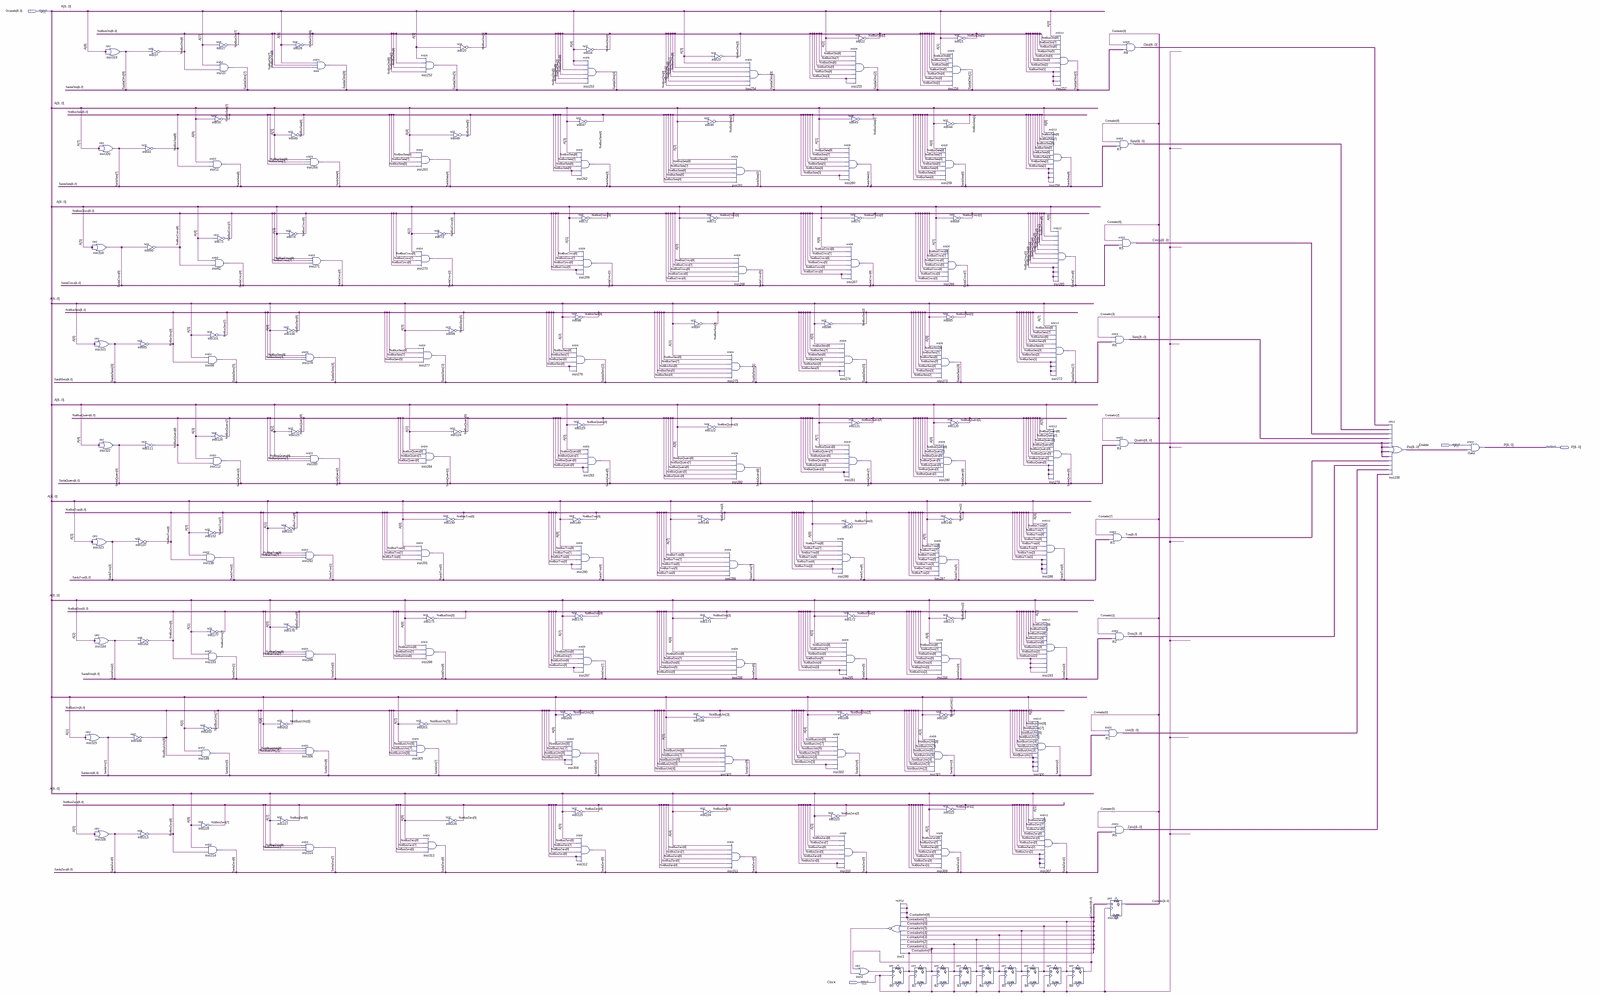
[diagram p0: schematic sheet, whole]
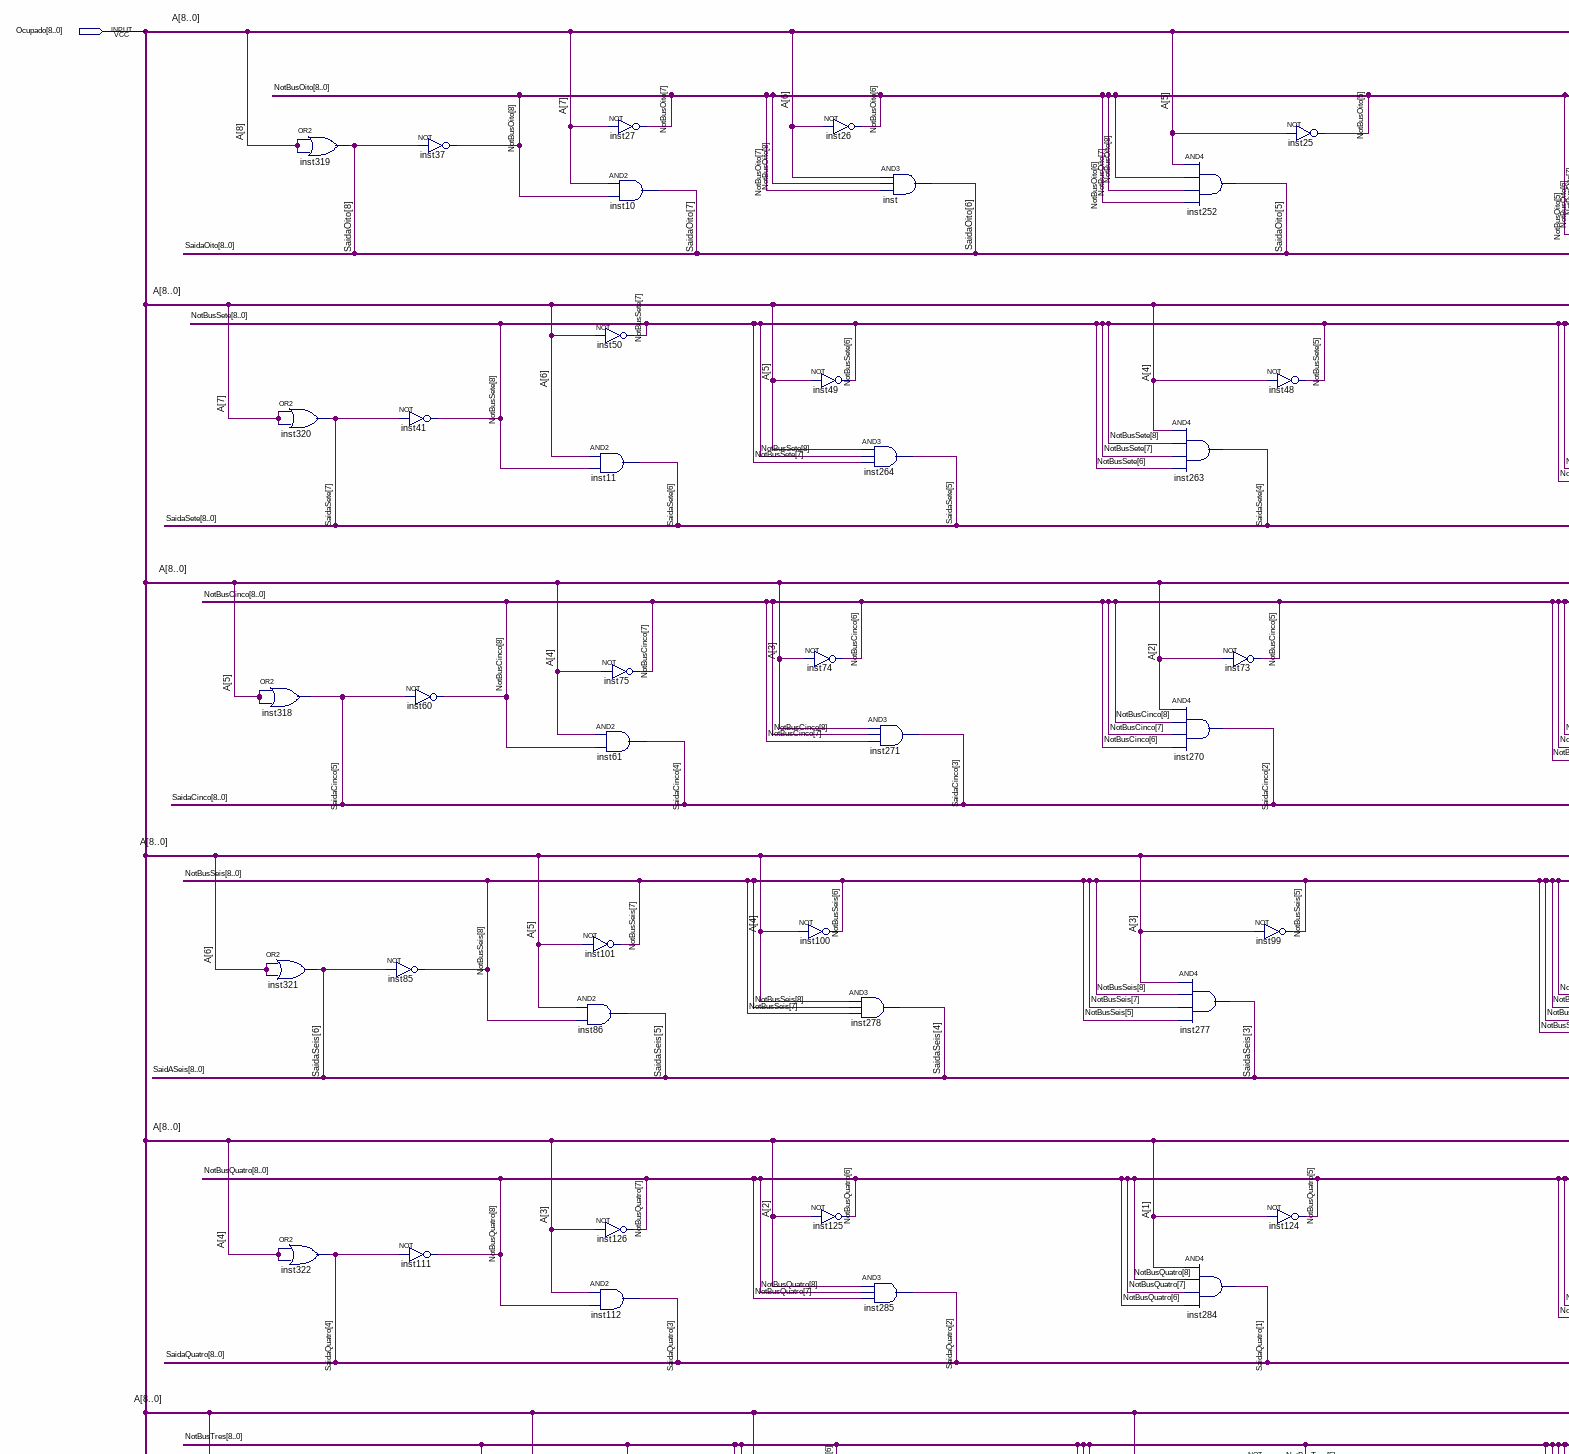
[diagram p1: schematic sheet, upper left part]
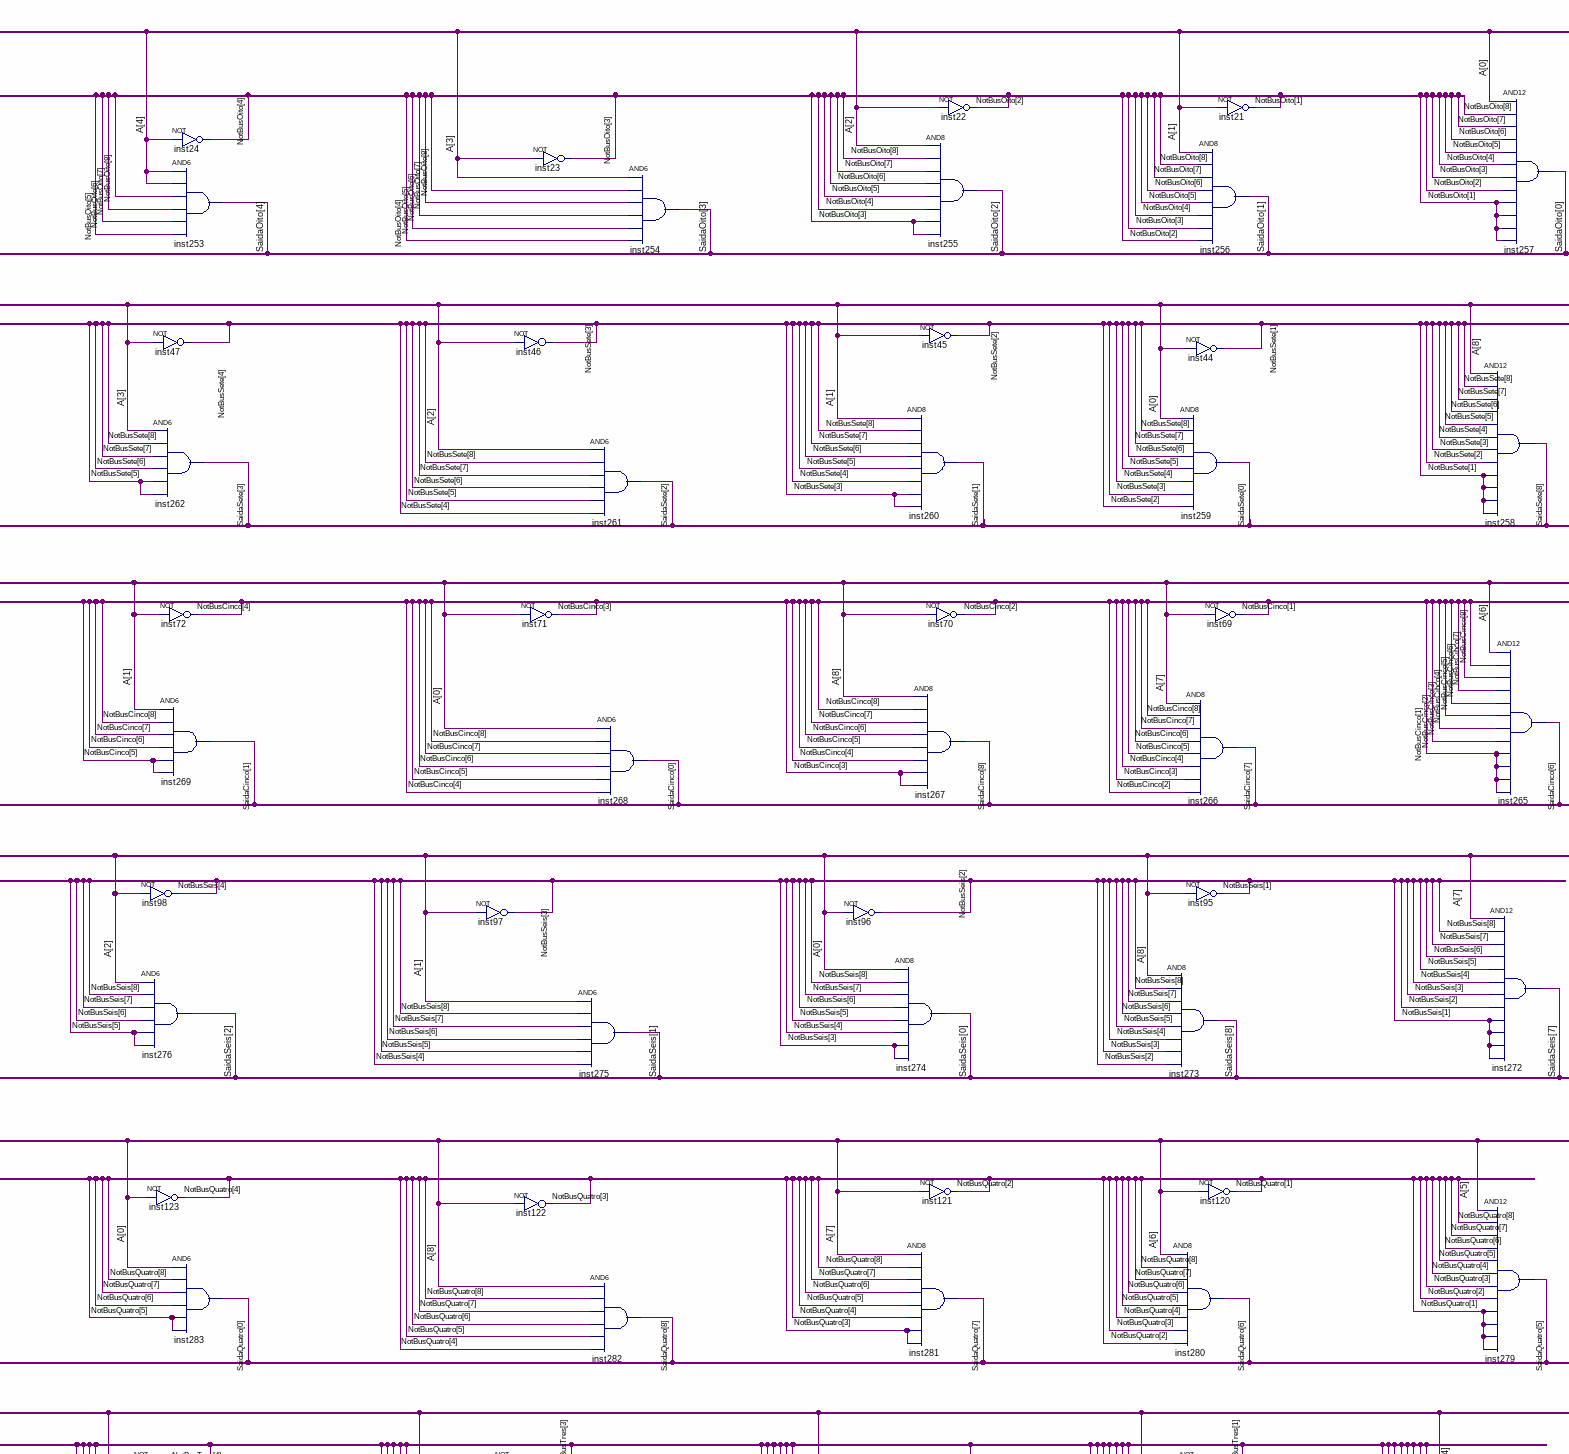
[diagram p2: schematic sheet, upper centre part]
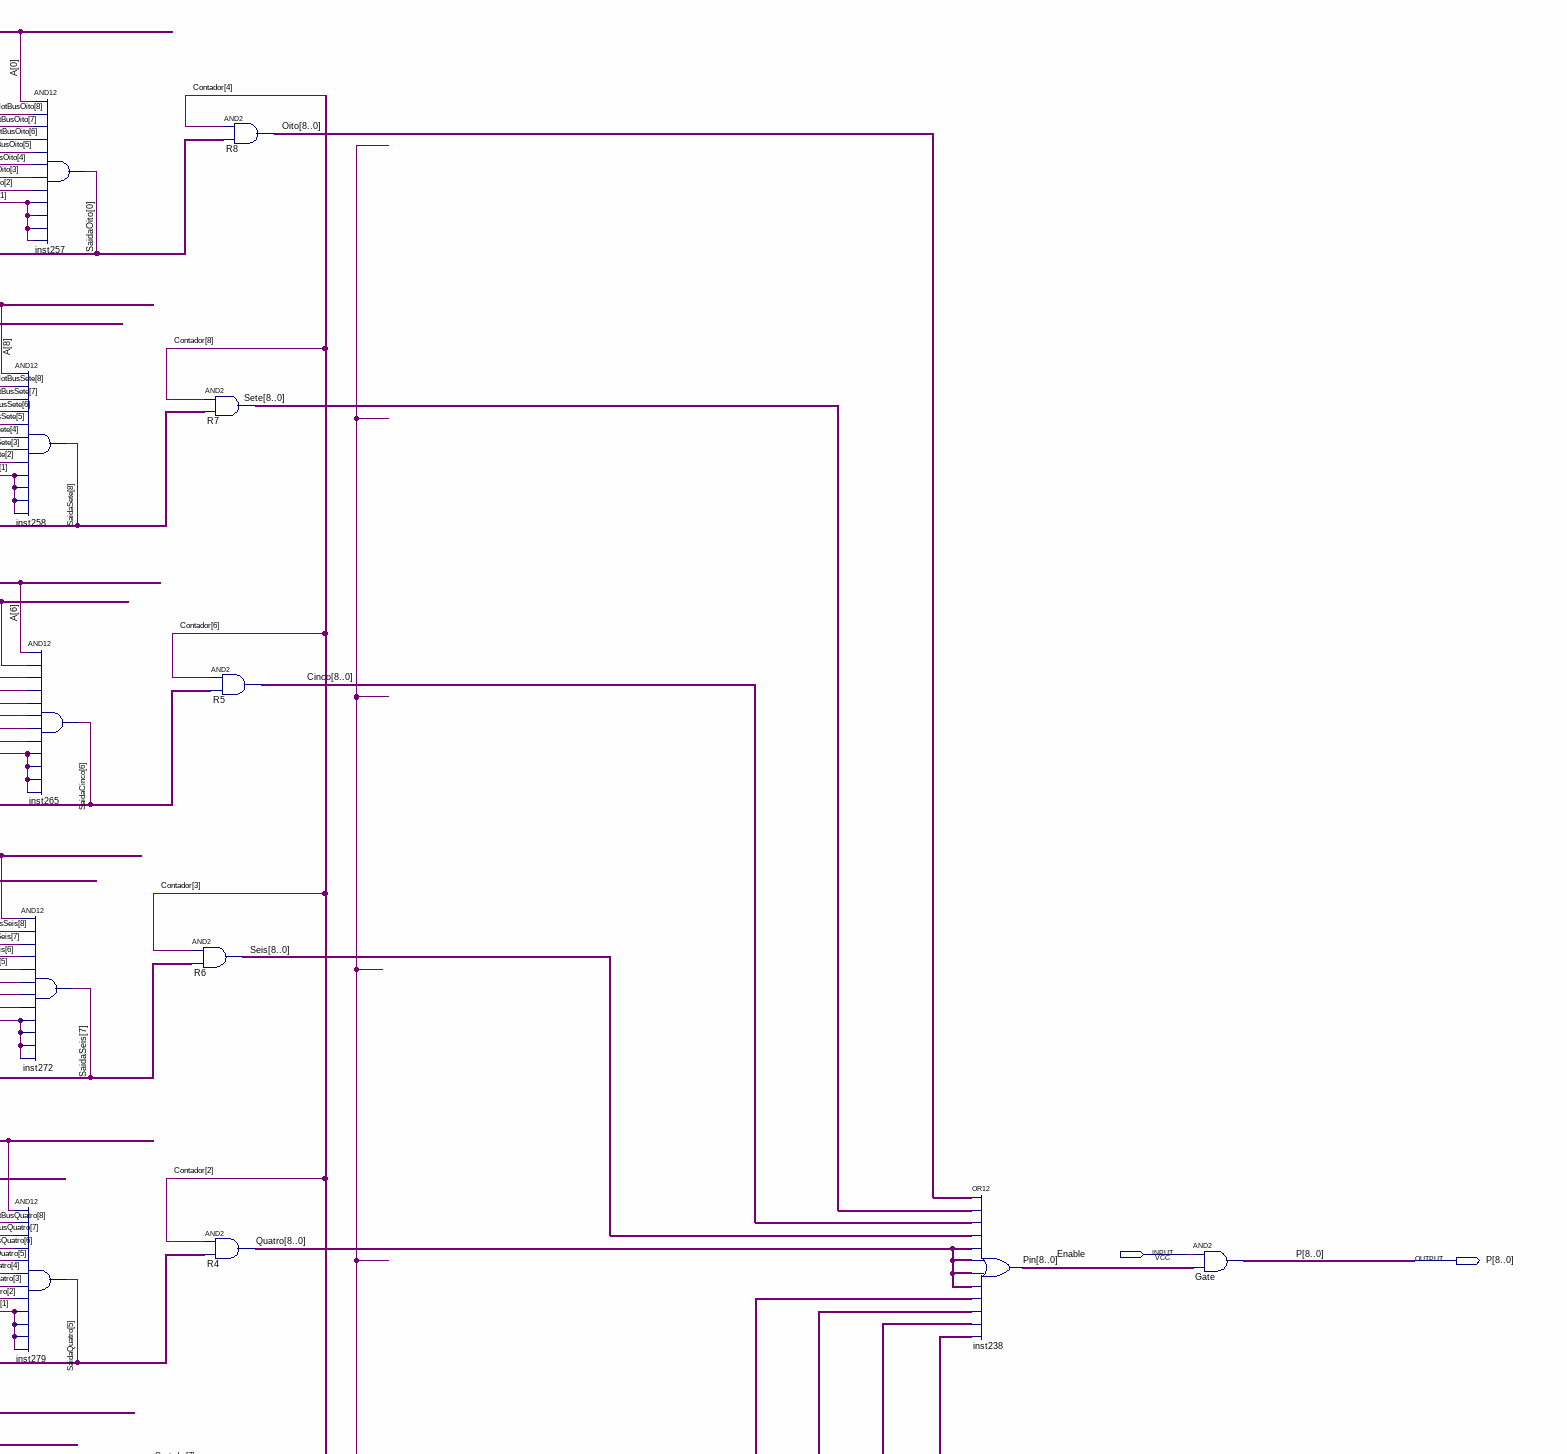
[diagram p3: schematic sheet, upper right part]
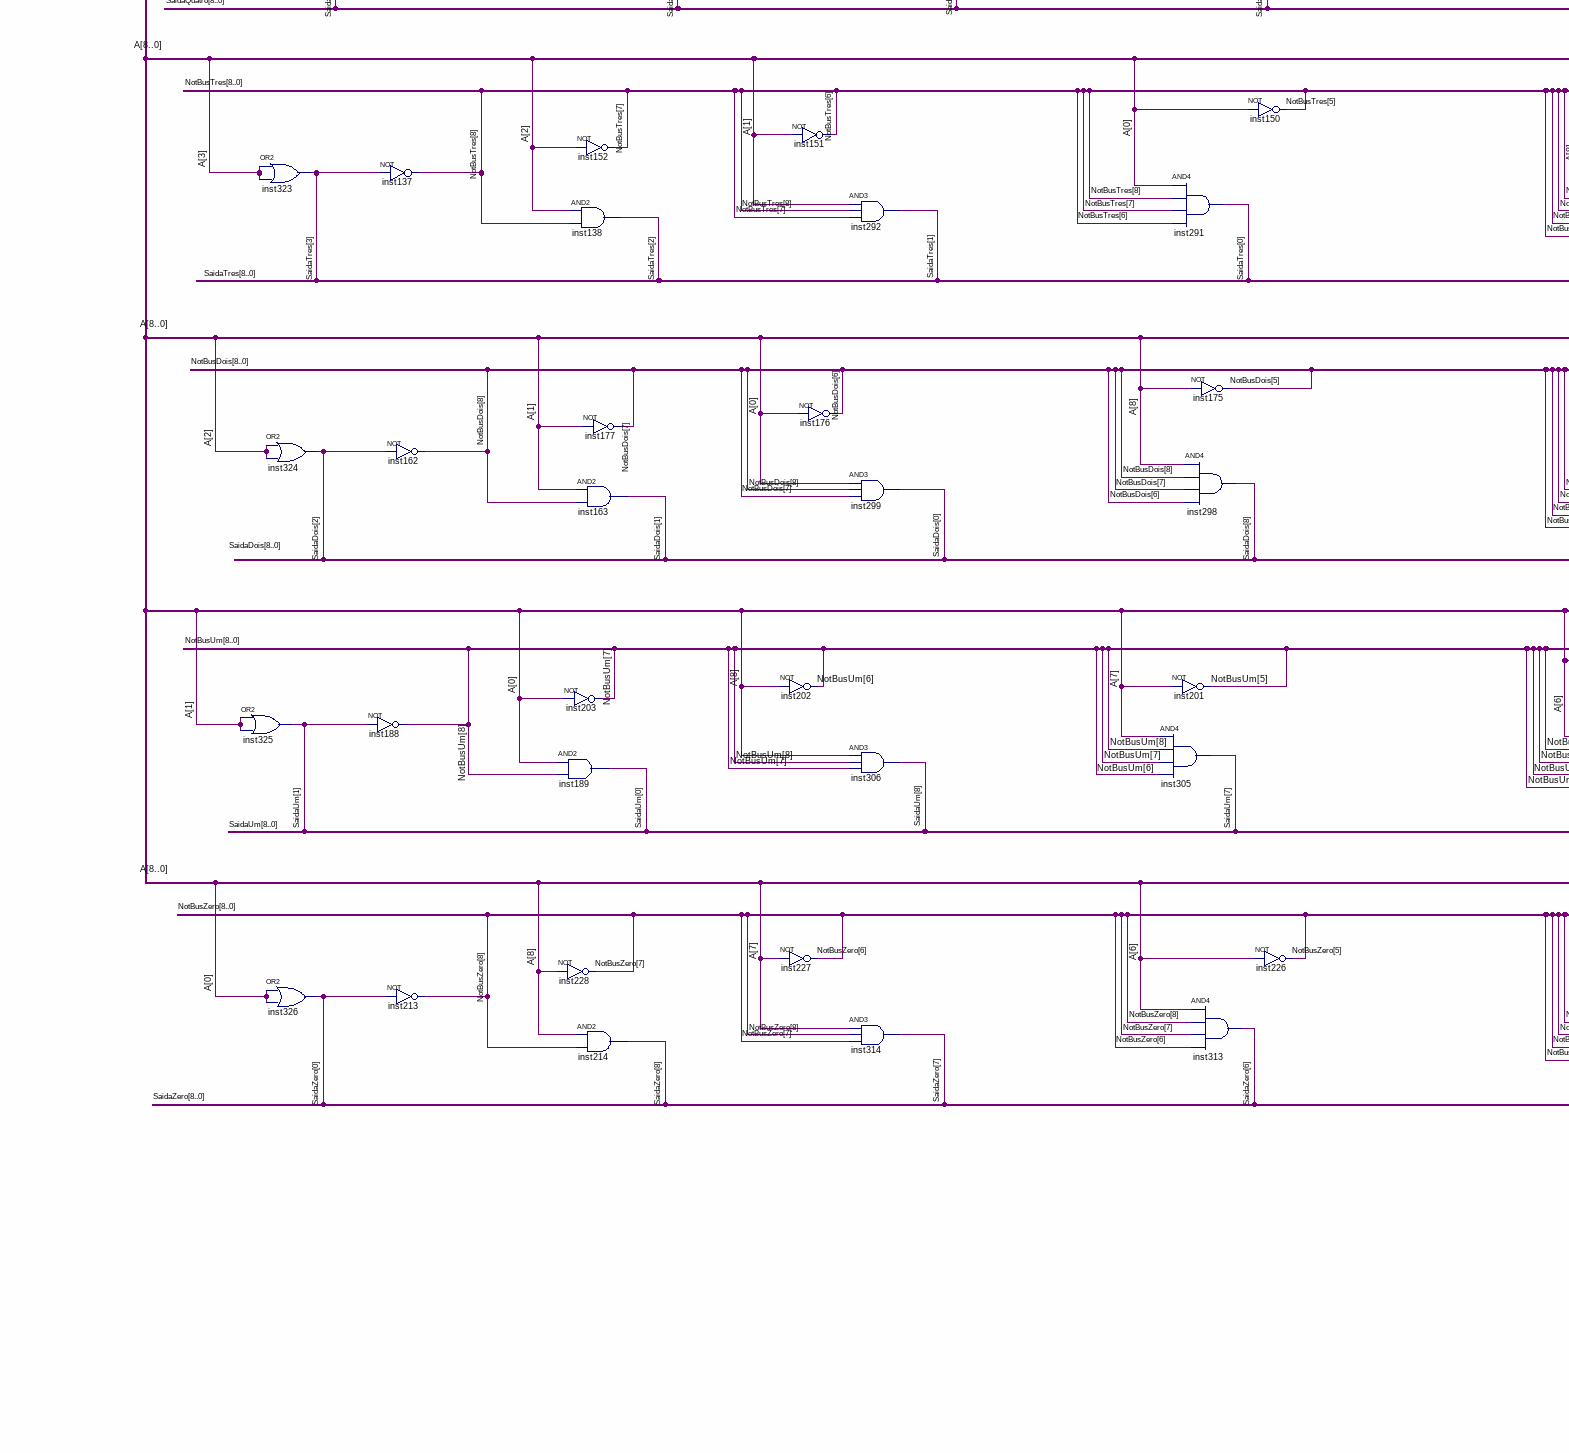
[diagram p4: schematic sheet, lower left part]
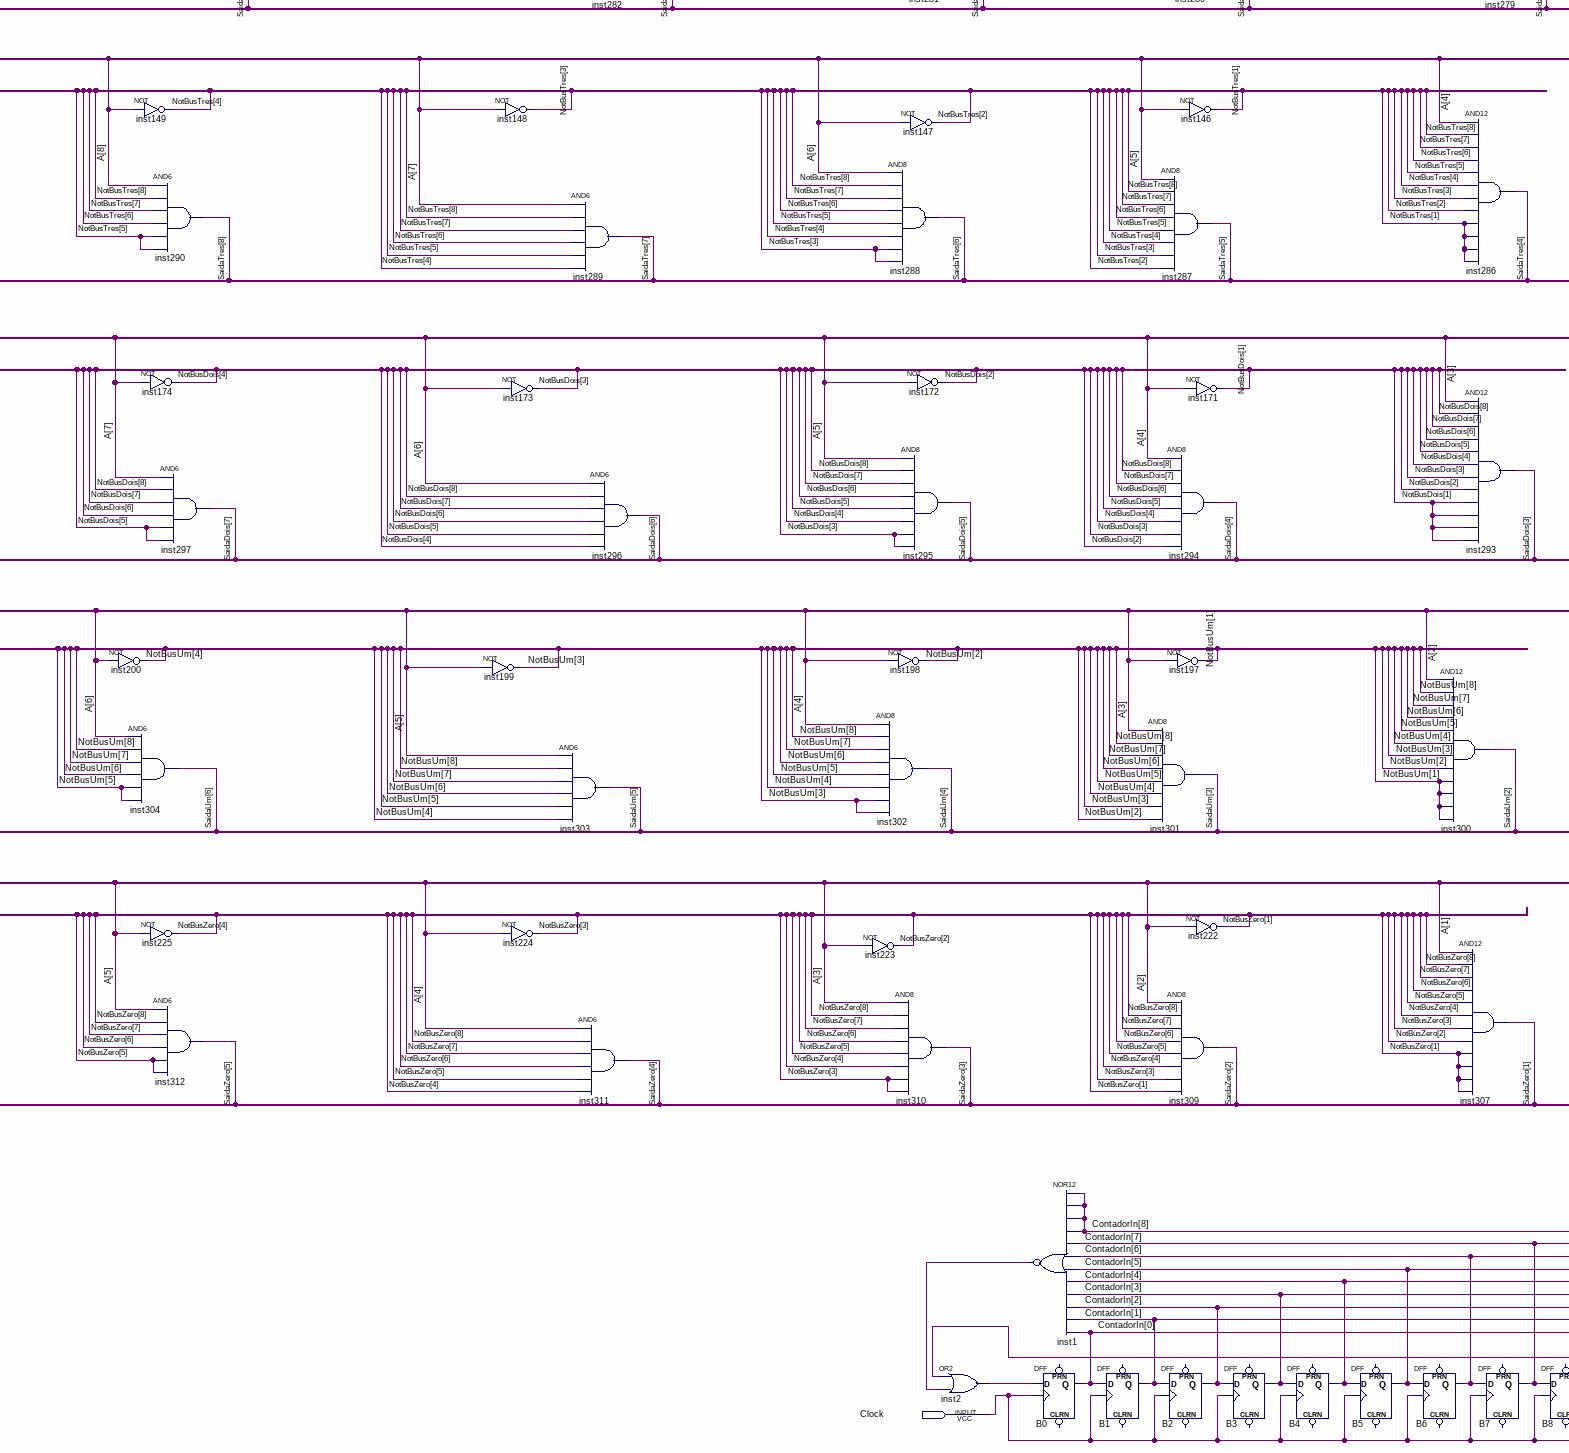
[diagram p5: schematic sheet, lower centre part]
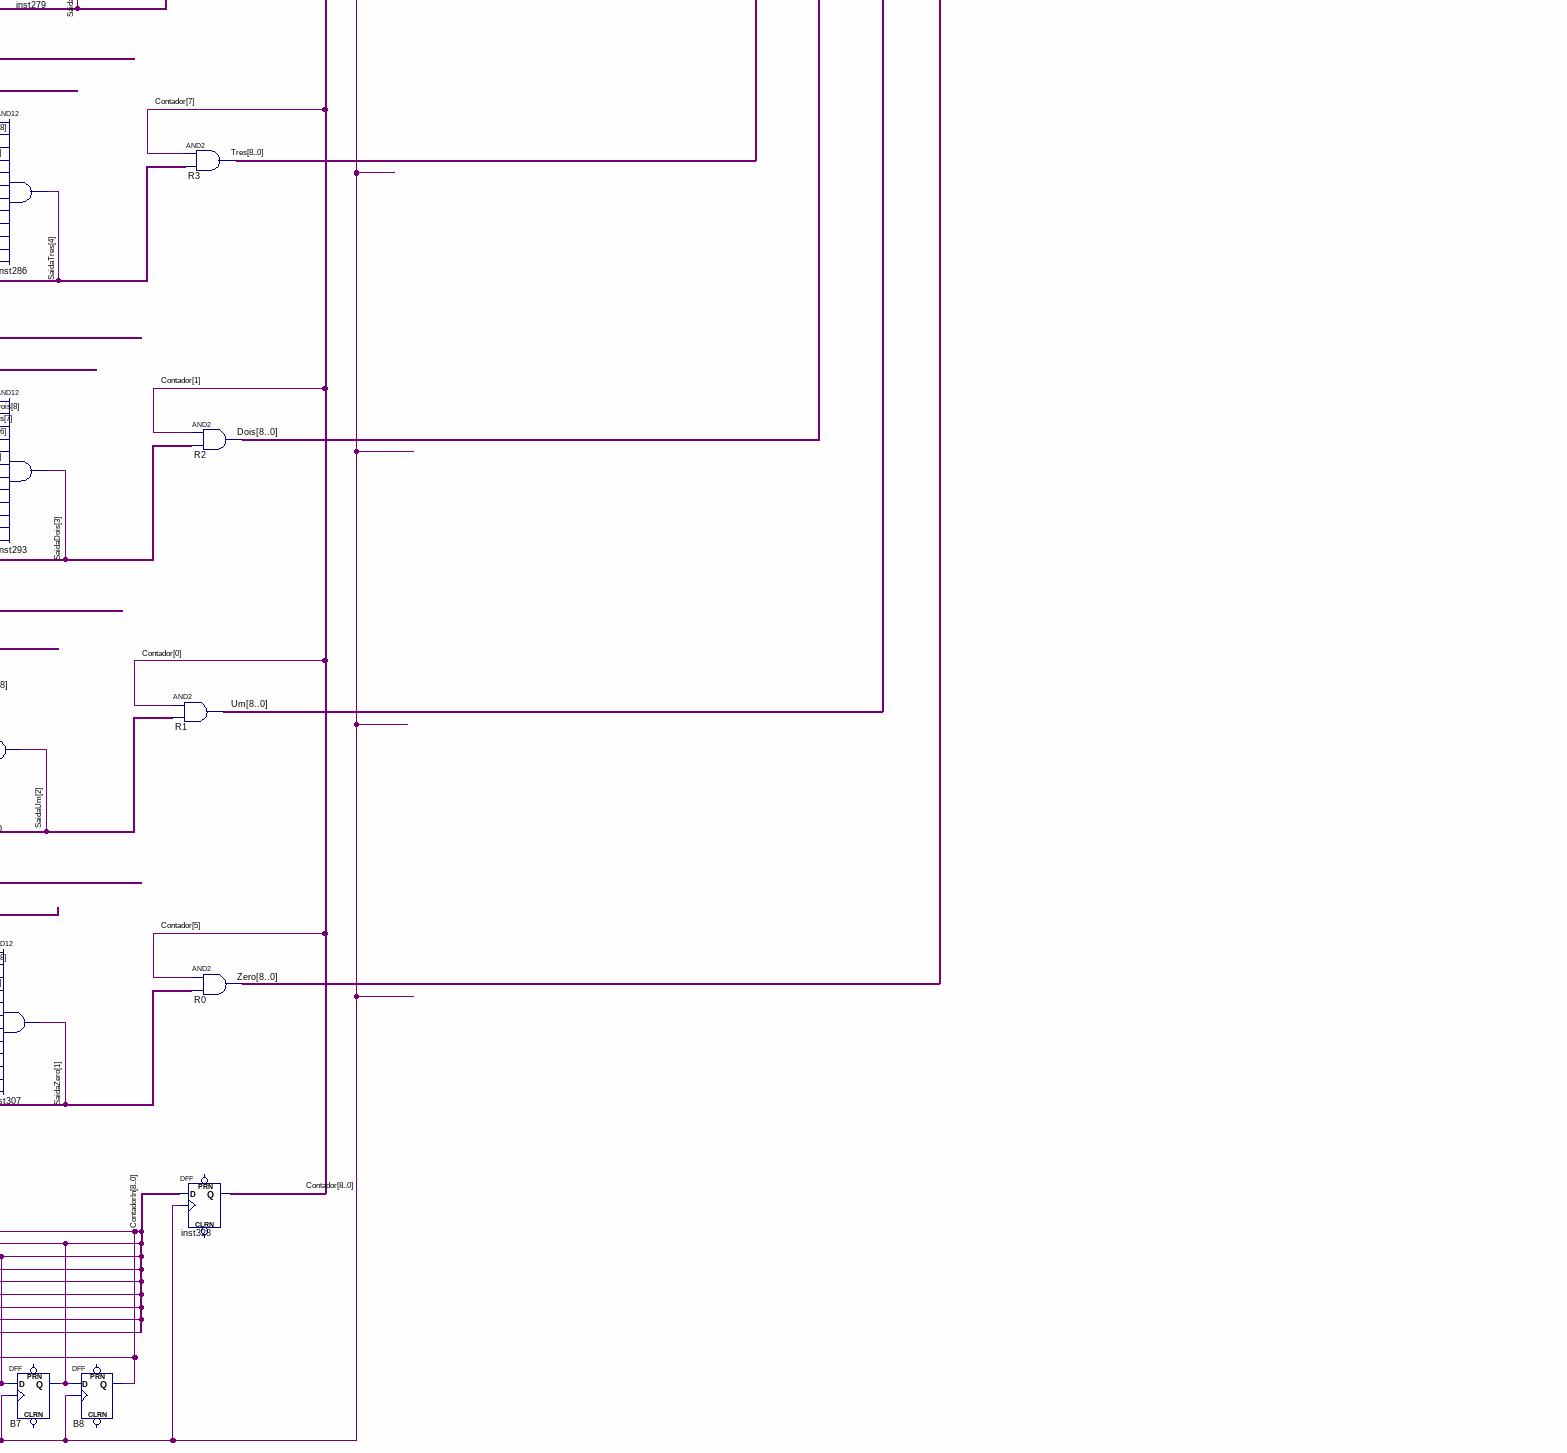
[diagram p6: schematic sheet, lower right part]
// Quartus schematic FRandom.bdf as structural Verilog: 176 symbols, 4 pins
module FRandom (
  input  [8:0] Ocupado,
  input  Enable,
  input  Clock,
  output [8:0] P
);

  wire inst1_out, inst2_out;
  wire [8:0] Cinco, Contador, ContadorIn, Dois, Oito, Pin, Quatro, SaidaCinco, SaidaDois, SaidaOito,
       SaidaQuatro, SaidASeis, SaidaSete, SaidaTres, SaidaUm, SaidaZero, Seis, Sete, Tres, Um, Zero;
  wire [8:1] NotBusCinco, NotBusDois, NotBusOito, NotBusQuatro, NotBusSeis, NotBusSete, NotBusTres, NotBusUm,
       NotBusZero;

  or inst318 (SaidaCinco[5], Ocupado[5], Ocupado[5]);
  or inst321 (SaidASeis[6], Ocupado[6], Ocupado[6]);
  or inst323 (SaidaTres[3], Ocupado[3], Ocupado[3]);
  or inst324 (SaidaDois[2], Ocupado[2], Ocupado[2]);
  or inst325 (SaidaUm[1], Ocupado[1], Ocupado[1]);
  or inst326 (SaidaZero[0], Ocupado[0], Ocupado[0]);
  or inst319 (SaidaOito[8], Ocupado[8], Ocupado[8]);
  or inst320 (SaidaSete[7], Ocupado[7], Ocupado[7]);
  or inst322 (SaidaQuatro[4], Ocupado[4], Ocupado[4]);
  not inst188 (NotBusUm[8], SaidaUm[1]);
  not inst37 (NotBusOito[8], SaidaOito[8]);
  not inst41 (NotBusSete[8], SaidaSete[7]);
  not inst60 (NotBusCinco[8], SaidaCinco[5]);
  not inst85 (NotBusSeis[8], SaidASeis[6]);
  not inst111 (NotBusQuatro[8], SaidaQuatro[4]);
  not inst137 (NotBusTres[8], SaidaTres[3]);
  not inst162 (NotBusDois[8], SaidaDois[2]);
  not inst213 (NotBusZero[8], SaidaZero[0]);
  and inst86 (SaidASeis[5], Ocupado[5], NotBusSeis[8]);
  not inst152 (NotBusTres[7], Ocupado[2]);
  and inst138 (SaidaTres[2], Ocupado[2], NotBusTres[8]);
  and inst163 (SaidaDois[1], Ocupado[1], NotBusDois[8]);
  not inst203 (NotBusUm[7], Ocupado[0]);
  and inst189 (SaidaUm[0], Ocupado[0], NotBusUm[8]);
  not inst228 (NotBusZero[7], Ocupado[8]);
  and inst214 (SaidaZero[8], Ocupado[8], NotBusZero[8]);
  not inst27 (NotBusOito[7], Ocupado[7]);
  and inst10 (SaidaOito[7], Ocupado[7], NotBusOito[8]);
  not inst50 (NotBusSete[7], Ocupado[6]);
  and inst11 (SaidaSete[6], Ocupado[6], NotBusSete[8]);
  not inst75 (NotBusCinco[7], Ocupado[4]);
  and inst61 (SaidaCinco[4], Ocupado[4], NotBusCinco[8]);
  not inst101 (NotBusSeis[7], Ocupado[5]);
  not inst126 (NotBusQuatro[7], Ocupado[3]);
  and inst112 (SaidaQuatro[3], Ocupado[3], NotBusQuatro[8]);
  not inst177 (NotBusDois[7], Ocupado[1]);
  not inst202 (NotBusUm[6], Ocupado[8]);
  not inst227 (NotBusZero[6], Ocupado[7]);
  not inst26 (NotBusOito[6], Ocupado[6]);
  not inst49 (NotBusSete[6], Ocupado[5]);
  not inst74 (NotBusCinco[6], Ocupado[3]);
  not inst100 (NotBusSeis[6], Ocupado[4]);
  not inst125 (NotBusQuatro[6], Ocupado[2]);
  not inst151 (NotBusTres[6], Ocupado[1]);
  not inst176 (NotBusDois[6], Ocupado[0]);
  and inst (SaidaOito[6], Ocupado[6], NotBusOito[8], NotBusOito[7]);
  and inst264 (SaidaSete[5], Ocupado[5], NotBusSete[8], NotBusSete[7]);
  and inst271 (SaidaCinco[3], Ocupado[3], NotBusCinco[8], NotBusCinco[7]);
  and inst278 (SaidASeis[4], Ocupado[4], NotBusSeis[8], NotBusSeis[7]);
  and inst285 (SaidaQuatro[2], Ocupado[2], NotBusQuatro[8], NotBusQuatro[7]);
  and inst292 (SaidaTres[1], Ocupado[1], NotBusTres[8], NotBusTres[7]);
  and inst299 (SaidaDois[0], Ocupado[0], NotBusDois[8], NotBusDois[7]);
  and inst306 (SaidaUm[8], Ocupado[8], NotBusUm[8], NotBusUm[7]);
  and inst314 (SaidaZero[7], Ocupado[7], NotBusZero[8], NotBusZero[7]);
  and inst252 (SaidaOito[5], Ocupado[5], NotBusOito[8], NotBusOito[7], NotBusOito[6]);
  and inst263 (SaidaSete[4], Ocupado[4], NotBusSete[8], NotBusSete[7], NotBusSete[6]);
  and inst270 (SaidaCinco[2], Ocupado[2], NotBusCinco[8], NotBusCinco[7], NotBusCinco[6]);
  and inst277 (SaidASeis[3], Ocupado[3], NotBusSeis[8], NotBusSeis[7], NotBusSeis[5]);
  and inst284 (SaidaQuatro[1], Ocupado[1], NotBusQuatro[8], NotBusQuatro[7], NotBusQuatro[6]);
  and inst291 (SaidaTres[0], Ocupado[0], NotBusTres[8], NotBusTres[7], NotBusTres[6]);
  and inst298 (SaidaDois[8], Ocupado[8], NotBusDois[8], NotBusDois[7], NotBusDois[6]);
  not inst201 (NotBusUm[5], Ocupado[7]);
  and inst305 (SaidaUm[7], Ocupado[7], NotBusUm[8], NotBusUm[7], NotBusUm[6]);
  not inst73 (NotBusCinco[5], Ocupado[2]);
  not inst175 (NotBusDois[5], Ocupado[8]);
  and inst313 (SaidaZero[6], Ocupado[6], NotBusZero[8], NotBusZero[7], NotBusZero[6]);
  not inst25 (NotBusOito[5], Ocupado[5]);
  not inst48 (NotBusSete[5], Ocupado[4]);
  not inst99 (NotBusSeis[5], Ocupado[3]);
  not inst124 (NotBusQuatro[5], Ocupado[1]);
  not inst150 (NotBusTres[5], Ocupado[0]);
  not inst226 (NotBusZero[5], Ocupado[6]);
  not inst200 (NotBusUm[4], Ocupado[6]);
  not inst24 (NotBusOito[4], Ocupado[4]);
  and inst253 (SaidaOito[4], Ocupado[4], Ocupado[4], NotBusOito[8], NotBusOito[7], NotBusOito[6], NotBusOito[5]);
  not inst47 (NotBusSete[4], Ocupado[3]);
  and inst262 (SaidaSete[3], Ocupado[3], NotBusSete[8], NotBusSete[7], NotBusSete[6], NotBusSete[5], NotBusSete[5]);
  not inst72 (NotBusCinco[4], Ocupado[1]);
  and inst269 (SaidaCinco[1], Ocupado[1], NotBusCinco[8], NotBusCinco[7], NotBusCinco[6], NotBusCinco[5], NotBusCinco[5]);
  not inst98 (NotBusSeis[4], Ocupado[2]);
  and inst276 (SaidASeis[2], Ocupado[2], NotBusSeis[8], NotBusSeis[7], NotBusSeis[6], NotBusSeis[5], NotBusSeis[5]);
  not inst123 (NotBusQuatro[4], Ocupado[0]);
  and inst283 (SaidaQuatro[0], Ocupado[0], NotBusQuatro[8], NotBusQuatro[7], NotBusQuatro[6], NotBusQuatro[5], NotBusQuatro[5]);
  not inst149 (NotBusTres[4], Ocupado[8]);
  and inst290 (SaidaTres[8], Ocupado[8], NotBusTres[8], NotBusTres[7], NotBusTres[6], NotBusTres[5], NotBusTres[5]);
  not inst174 (NotBusDois[4], Ocupado[7]);
  and inst297 (SaidaDois[7], Ocupado[7], NotBusDois[8], NotBusDois[7], NotBusDois[6], NotBusDois[5], NotBusDois[5]);
  and inst304 (SaidaUm[6], Ocupado[6], NotBusUm[8], NotBusUm[7], NotBusUm[6], NotBusUm[5], NotBusUm[5]);
  not inst225 (NotBusZero[4], Ocupado[5]);
  and inst312 (SaidaZero[5], Ocupado[5], NotBusZero[8], NotBusZero[7], NotBusZero[6], NotBusZero[5], NotBusZero[5]);
  not inst97 (NotBusSeis[3], Ocupado[1]);
  not inst46 (NotBusSete[3], Ocupado[2]);
  not inst71 (NotBusCinco[3], Ocupado[0]);
  not inst122 (NotBusQuatro[3], Ocupado[8]);
  not inst148 (NotBusTres[3], Ocupado[7]);
  not inst173 (NotBusDois[3], Ocupado[6]);
  not inst199 (NotBusUm[3], Ocupado[5]);
  not inst224 (NotBusZero[3], Ocupado[4]);
  not inst23 (NotBusOito[3], Ocupado[3]);
  and inst275 (SaidASeis[1], Ocupado[1], NotBusSeis[8], NotBusSeis[7], NotBusSeis[6], NotBusSeis[5], NotBusSeis[4]);
  and inst289 (SaidaTres[7], Ocupado[7], NotBusTres[8], NotBusTres[7], NotBusTres[6], NotBusTres[5], NotBusTres[4]);
  and inst303 (SaidaUm[5], Ocupado[5], NotBusUm[8], NotBusUm[7], NotBusUm[6], NotBusUm[5], NotBusUm[4]);
  and inst311 (SaidaZero[4], Ocupado[4], NotBusZero[8], NotBusZero[7], NotBusZero[6], NotBusZero[5], NotBusZero[4]);
  and inst254 (SaidaOito[3], Ocupado[3], NotBusOito[8], NotBusOito[7], NotBusOito[6], NotBusOito[5], NotBusOito[4]);
  and inst261 (SaidaSete[2], Ocupado[2], NotBusSete[8], NotBusSete[7], NotBusSete[6], NotBusSete[5], NotBusSete[4]);
  and inst268 (SaidaCinco[0], Ocupado[0], NotBusCinco[8], NotBusCinco[7], NotBusCinco[6], NotBusCinco[5], NotBusCinco[4]);
  and inst282 (SaidaQuatro[8], Ocupado[8], NotBusQuatro[8], NotBusQuatro[7], NotBusQuatro[6], NotBusQuatro[5], NotBusQuatro[4]);
  and inst296 (SaidaDois[6], Ocupado[6], NotBusDois[8], NotBusDois[7], NotBusDois[6], NotBusDois[5], NotBusDois[4]);
  not inst96 (NotBusSeis[2], Ocupado[0]);
  and inst302 (SaidaUm[4], Ocupado[4], NotBusUm[8], NotBusUm[7], NotBusUm[6], NotBusUm[5], NotBusUm[4], NotBusUm[3], NotBusUm[3]);
  not inst223 (NotBusZero[2], Ocupado[3]);
  and inst255 (SaidaOito[2], Ocupado[2], NotBusOito[8], NotBusOito[7], NotBusOito[6], NotBusOito[5], NotBusOito[4], NotBusOito[3], NotBusOito[3]);
  not inst45 (NotBusSete[2], Ocupado[1]);
  and inst260 (SaidaSete[1], Ocupado[1], NotBusSete[8], NotBusSete[7], NotBusSete[6], NotBusSete[5], NotBusSete[4], NotBusSete[3], NotBusSete[3]);
  not inst70 (NotBusCinco[2], Ocupado[8]);
  and inst267 (SaidaCinco[8], Ocupado[8], NotBusCinco[8], NotBusCinco[7], NotBusCinco[6], NotBusCinco[5], NotBusCinco[4], NotBusCinco[3], NotBusCinco[3]);
  and inst274 (SaidASeis[0], Ocupado[0], NotBusSeis[8], NotBusSeis[7], NotBusSeis[6], NotBusSeis[5], NotBusSeis[4], NotBusSeis[3], NotBusSeis[3]);
  not inst121 (NotBusQuatro[2], Ocupado[7]);
  and inst281 (SaidaQuatro[7], Ocupado[7], NotBusQuatro[8], NotBusQuatro[7], NotBusQuatro[6], NotBusQuatro[5], NotBusQuatro[4], NotBusQuatro[3], NotBusQuatro[3]);
  not inst147 (NotBusTres[2], Ocupado[6]);
  and inst288 (SaidaTres[6], Ocupado[6], NotBusTres[8], NotBusTres[7], NotBusTres[6], NotBusTres[5], NotBusTres[4], NotBusTres[3], NotBusTres[3]);
  not inst172 (NotBusDois[2], Ocupado[5]);
  and inst295 (SaidaDois[5], Ocupado[5], NotBusDois[8], NotBusDois[7], NotBusDois[6], NotBusDois[5], NotBusDois[4], NotBusDois[3], NotBusDois[3]);
  not inst198 (NotBusUm[2], Ocupado[4]);
  and inst310 (SaidaZero[3], Ocupado[3], NotBusZero[8], NotBusZero[7], NotBusZero[6], NotBusZero[5], NotBusZero[4], NotBusZero[3], NotBusZero[3]);
  not inst22 (NotBusOito[2], Ocupado[2]);
  or inst2 (inst2_out, ContadorIn[8], inst1_out);
  nor inst1 (inst1_out, ContadorIn[8], ContadorIn[8], ContadorIn[8], ContadorIn[8], ContadorIn[7], ContadorIn[6], ContadorIn[5], ContadorIn[4], ContadorIn[3], ContadorIn[2], ContadorIn[1], ContadorIn[0]);
  DFF B0 (.CLK(Clock), .D(inst2_out), .Q(ContadorIn[0]));  // open: CLRN, PRN
  DFF B1 (.CLK(Clock), .D(ContadorIn[0]), .Q(ContadorIn[1]));  // open: CLRN, PRN
  not inst44 (NotBusSete[1], Ocupado[0]);
  and inst259 (SaidaSete[0], Ocupado[0], NotBusSete[8], NotBusSete[7], NotBusSete[6], NotBusSete[5], NotBusSete[4], NotBusSete[3], NotBusSete[2]);
  and inst266 (SaidaCinco[7], Ocupado[7], NotBusCinco[8], NotBusCinco[7], NotBusCinco[6], NotBusCinco[5], NotBusCinco[4], NotBusCinco[3], NotBusCinco[2]);
  not inst95 (NotBusSeis[1], Ocupado[8]);
  and inst273 (SaidASeis[8], Ocupado[8], NotBusSeis[8], NotBusSeis[7], NotBusSeis[6], NotBusSeis[5], NotBusSeis[4], NotBusSeis[3], NotBusSeis[2]);
  and inst280 (SaidaQuatro[6], Ocupado[6], NotBusQuatro[8], NotBusQuatro[7], NotBusQuatro[6], NotBusQuatro[5], NotBusQuatro[4], NotBusQuatro[3], NotBusQuatro[2]);
  not inst146 (NotBusTres[1], Ocupado[5]);
  and inst287 (SaidaTres[5], Ocupado[5], NotBusTres[8], NotBusTres[7], NotBusTres[6], NotBusTres[5], NotBusTres[4], NotBusTres[3], NotBusTres[2]);
  not inst171 (NotBusDois[1], Ocupado[4]);
  and inst294 (SaidaDois[4], Ocupado[4], NotBusDois[8], NotBusDois[7], NotBusDois[6], NotBusDois[5], NotBusDois[4], NotBusDois[3], NotBusDois[2]);
  not inst197 (NotBusUm[1], Ocupado[3]);
  and inst301 (SaidaUm[3], Ocupado[3], NotBusUm[8], NotBusUm[7], NotBusUm[6], NotBusUm[5], NotBusUm[4], NotBusUm[3], NotBusUm[2]);
  not inst222 (NotBusZero[1], Ocupado[2]);
  and inst309 (SaidaZero[2], Ocupado[2], NotBusZero[8], NotBusZero[7], NotBusZero[6], NotBusZero[5], NotBusZero[4], NotBusZero[3], NotBusZero[1]);
  DFF B2 (.CLK(Clock), .D(ContadorIn[1]), .Q(ContadorIn[2]));  // open: CLRN, PRN
  not inst21 (NotBusOito[1], Ocupado[1]);
  and inst256 (SaidaOito[1], Ocupado[1], NotBusOito[8], NotBusOito[7], NotBusOito[6], NotBusOito[5], NotBusOito[4], NotBusOito[3], NotBusOito[2]);
  not inst69 (NotBusCinco[1], Ocupado[7]);
  not inst120 (NotBusQuatro[1], Ocupado[6]);
  DFF B3 (.CLK(Clock), .D(ContadorIn[2]), .Q(ContadorIn[3]));  // open: CLRN, PRN
  DFF B4 (.CLK(Clock), .D(ContadorIn[3]), .Q(ContadorIn[4]));  // open: CLRN, PRN
  DFF B5 (.CLK(Clock), .D(ContadorIn[4]), .Q(ContadorIn[5]));  // open: CLRN, PRN
  and inst300 (SaidaUm[2], Ocupado[2], NotBusUm[8], NotBusUm[7], NotBusUm[6], NotBusUm[5], NotBusUm[4], NotBusUm[3], NotBusUm[2], NotBusUm[1], NotBusUm[1], NotBusUm[1], NotBusUm[1]);
  DFF B6 (.CLK(Clock), .D(ContadorIn[5]), .Q(ContadorIn[6]));  // open: CLRN, PRN
  and inst258 (SaidaSete[8], Ocupado[8], NotBusSete[8], NotBusSete[7], NotBusSete[6], NotBusSete[5], NotBusSete[4], NotBusSete[3], NotBusSete[2], NotBusSete[1], NotBusSete[1], NotBusSete[1], NotBusSete[1]);
  and inst272 (SaidASeis[7], Ocupado[7], NotBusSeis[8], NotBusSeis[7], NotBusSeis[6], NotBusSeis[5], NotBusSeis[4], NotBusSeis[3], NotBusSeis[2], NotBusSeis[1], NotBusSeis[1], NotBusSeis[1], NotBusSeis[1]);
  and inst279 (SaidaQuatro[5], Ocupado[5], NotBusQuatro[8], NotBusQuatro[7], NotBusQuatro[6], NotBusQuatro[5], NotBusQuatro[4], NotBusQuatro[3], NotBusQuatro[2], NotBusQuatro[1], NotBusQuatro[1], NotBusQuatro[1], NotBusQuatro[1]);
  and inst286 (SaidaTres[4], Ocupado[4], NotBusTres[8], NotBusTres[7], NotBusTres[6], NotBusTres[5], NotBusTres[4], NotBusTres[3], NotBusTres[2], NotBusTres[1], NotBusTres[1], NotBusTres[1], NotBusTres[1]);
  and inst293 (SaidaDois[3], Ocupado[3], NotBusDois[8], NotBusDois[7], NotBusDois[6], NotBusDois[5], NotBusDois[4], NotBusDois[3], NotBusDois[2], NotBusDois[1], NotBusDois[1], NotBusDois[1], NotBusDois[1]);
  and inst307 (SaidaZero[1], Ocupado[1], NotBusZero[8], NotBusZero[7], NotBusZero[6], NotBusZero[5], NotBusZero[4], NotBusZero[3], NotBusZero[2], NotBusZero[1], NotBusZero[1], NotBusZero[1], NotBusZero[1]);
  DFF B7 (.CLK(Clock), .D(ContadorIn[6]), .Q(ContadorIn[7]));  // open: CLRN, PRN
  and inst257 (SaidaOito[0], Ocupado[0], NotBusOito[8], NotBusOito[7], NotBusOito[6], NotBusOito[5], NotBusOito[4], NotBusOito[3], NotBusOito[2], NotBusOito[1], NotBusOito[1], NotBusOito[1], NotBusOito[1]);
  and inst265 (SaidaCinco[6], Ocupado[6], NotBusCinco[8], NotBusCinco[7], NotBusCinco[6], NotBusCinco[5], NotBusCinco[4], NotBusCinco[3], NotBusCinco[2], NotBusCinco[1], NotBusCinco[1], NotBusCinco[1], NotBusCinco[1]);
  DFF B8 (.CLK(Clock), .D(ContadorIn[7]), .Q(ContadorIn[8]));  // open: CLRN, PRN
  assign Um = {9{Contador[0]}} & SaidaUm;  // AND2 R1, 9 bits wide
  assign Oito = {9{Contador[4]}} & SaidaOito;  // AND2 R8, 9 bits wide
  assign Sete = {9{Contador[8]}} & SaidaSete;  // AND2 R7, 9 bits wide
  assign Cinco = {9{Contador[6]}} & SaidaCinco;  // AND2 R5, 9 bits wide
  assign Seis = {9{Contador[3]}} & SaidASeis;  // AND2 R6, 9 bits wide
  assign Quatro = {9{Contador[2]}} & SaidaQuatro;  // AND2 R4, 9 bits wide
  assign Tres = {9{Contador[7]}} & SaidaTres;  // AND2 R3, 9 bits wide
  assign Dois = {9{Contador[1]}} & SaidaDois;  // AND2 R2, 9 bits wide
  assign Zero = {9{Contador[5]}} & SaidaZero;  // AND2 R0, 9 bits wide
  DFF inst328[8:0] (.CLK(Clock), .D(ContadorIn), .Q(Contador));  // open: CLRN, PRN
  assign Pin = Oito | Sete | Cinco | Seis | Quatro | Quatro | Quatro | Quatro | Tres | Dois | Um | Zero;  // OR12 inst238, 9 bits wide
  assign P = {9{Enable}} & Pin;  // AND2 Gate, 9 bits wide

  // Other names for the same wires on the sheet: A[8:0] = Ocupado
endmodule
